# Altium project neuro_module.PrjPcb (part 2 of 2)

## Sheet nm_rs485_phy.SchDoc
size 209 x 297 mm; SheetNumber: 3; SheetTotal: 9
Used 2 times, as channels lm_rs485, sop_rs485. Parts and nets are listed once, with the designators drawn on the sheet.
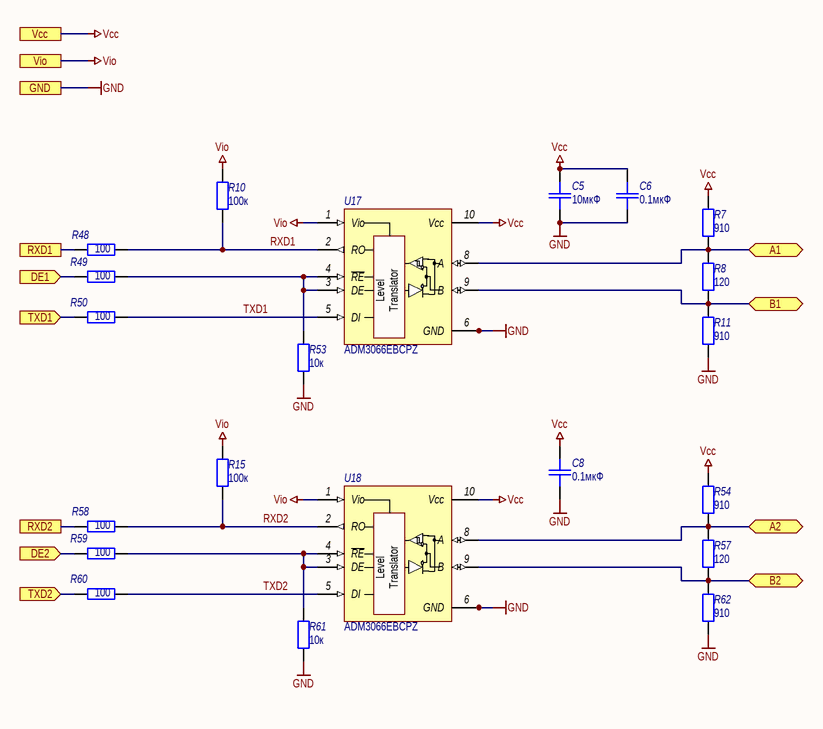
[diagram p7: nm_rs485_phy.SchDoc]

### Parts
C5  value 10мкФ  [SMD_C0603]  (hidden comment: Capacitor)
C6  value 0.1мкФ  [SMD_C0603]  (hidden comment: Capacitor)
C8  value 0.1мкФ  [SMD_C0603]  (hidden comment: Capacitor)
R7  value 910  [SMD_0603]  (hidden comment: Resistor)
R8  value 120  [SMD_0603]  (hidden comment: Resistor)
R10  value 100к  [SMD_0603]  (hidden comment: Resistor)
R11  value 910  [SMD_0603]  (hidden comment: Resistor)
R15  value 100к  [SMD_0603]  (hidden comment: Resistor)
R48  value 100  [SMD_0603]  (hidden comment: Resistor)
R49  value 100  [SMD_0603]  (hidden comment: Resistor)
R50  value 100  [SMD_0603]  (hidden comment: Resistor)
R53  value 10к  [SMD_0603]  (hidden comment: Resistor)
R54  value 910  [SMD_0603]  (hidden comment: Resistor)
R57  value 120  [SMD_0603]  (hidden comment: Resistor)
R58  value 100  [SMD_0603]  (hidden comment: Resistor)
R59  value 100  [SMD_0603]  (hidden comment: Resistor)
R60  value 100  [SMD_0603]  (hidden comment: Resistor)
R61  value 10к  [SMD_0603]  (hidden comment: Resistor)
R62  value 910  [SMD_0603]  (hidden comment: Resistor)
U17  ADM3066EBCPZ  [LFCSP-10_3x3]
U18  ADM3066EBCPZ  [LFCSP-10_3x3]

### Ports
A1 (bidir), A2 (bidir), B1 (bidir), B2 (bidir), DE1 (in), DE2 (in), GND, RXD1, RXD2, TXD1 (in), TXD2 (in), Vcc, Vio

### Nets
GND: C5.1 C6.1 C8.1 R11.1 R53.1 R61.1 R62.1 U17.6(GND) U17.11(GND) U18.6(GND) U18.11(GND) ; port GND
Vcc: C5.2 C6.2 C8.2 R7.1 R54.1 U17.10(Vcc) U18.10(Vcc) ; port Vcc
Vio: R10.1 R15.1 U17.1(Vio) U18.1(Vio) ; port Vio
A1: R7.2 R8.2 U17.8(A) ; port A1
A2: R54.2 R57.2 U18.8(A) ; port A2
B1: R8.1 R11.2 U17.9(B) ; port B1
B2: R57.1 R62.2 U18.9(B) ; port B2
DE1: R49.2 ; port DE1
DE2: R59.2 ; port DE2
RXD1: R10.2 R48.1 U17.2(RO)
RXD1: R48.2 ; port RXD1  [a separate net that carries the same name]
RXD2: R15.2 R58.1 U18.2(RO)
RXD2: R58.2 ; port RXD2  [a separate net that carries the same name]
TXD1: R50.1 U17.5(DI)
TXD1: R50.2 ; port TXD1  [a separate net that carries the same name]
TXD2: R60.1 U18.5(DI)
TXD2: R60.2 ; port TXD2  [a separate net that carries the same name]
NetR49_1: R49.1 R53.2 U17.3(DE) U17.4(~{RE})
NetR59_1: R59.1 R61.2 U18.3(DE) U18.4(~{RE})

### Channels
lm_rs485: designators end in _1; ports A1=A1 A2=A2 B1=B1 B2=B2 DE1=lm_rs485.DE DE2=lm2_rs485.DE GND=GND RXD1=lm_rs485.RX RXD2=lm2_rs485.RX TXD1=lm_rs485.TX TXD2=lm2_rs485.TX Vcc=3V3 Vio=3V3
sop_rs485: designators end in _2; ports A1=A1 A2=A2 B1=B1 B2=B2 DE1=sop_rs485.DE DE2=sop2_rs485.DE GND=GND RXD1=sop_rs485.RX RXD2=sop2_rs485.RX TXD1=sop_rs485.TX TXD2=sop2_rs485.TX Vcc=3V3 Vio=3V3

### Notes on the sheet
- Подп. и дата
- Инв. № дубл.
- Взам. инв. №
- Инв. № подл.
- Изм.
- Лист
- № докум.
- Подп.
- Дата
- Форма 2а ГОСТ 2.104-2006
- Копировал
- Формат А4
- (in symbol ADM3066E) Level; Translator

### Library data of the parts
C5 C6 C8 = Capacitor: Назначение: SMD-конденсатор; Наименование: Конденсатор; Потребление, Вт: 0; Точность: %; Напряжение: В; Диэлектрик: *; Place_v1: *; Place_v2: *
R7 R8 R10 R11 R15 R48-R50 R53 R54 R57-R62 = Resistor: Наименование: Резистор; Назначение: SMD-резистор; Потребление, Вт: 0,001; Точность: %; Place_v1: *; Place_v2: *
U17 U18 = ADM3066E: 3.0 V to 5.5 V, ±12 kV IEC ESD Protected, 500 kbps/50 Mbps RS-485 Transceiver; Потребление, Вт: 0,1; Наименование: ADM3066EBCPZ; Назначение: RS-485 Transceiver; Place_v1: =PL_RS_PLACE; Place_v2: =PL_RS_PLACE

## Sheet nm_temp_sens.SchDoc
size 209 x 297 mm; SheetNumber: 9; SheetTotal: 9
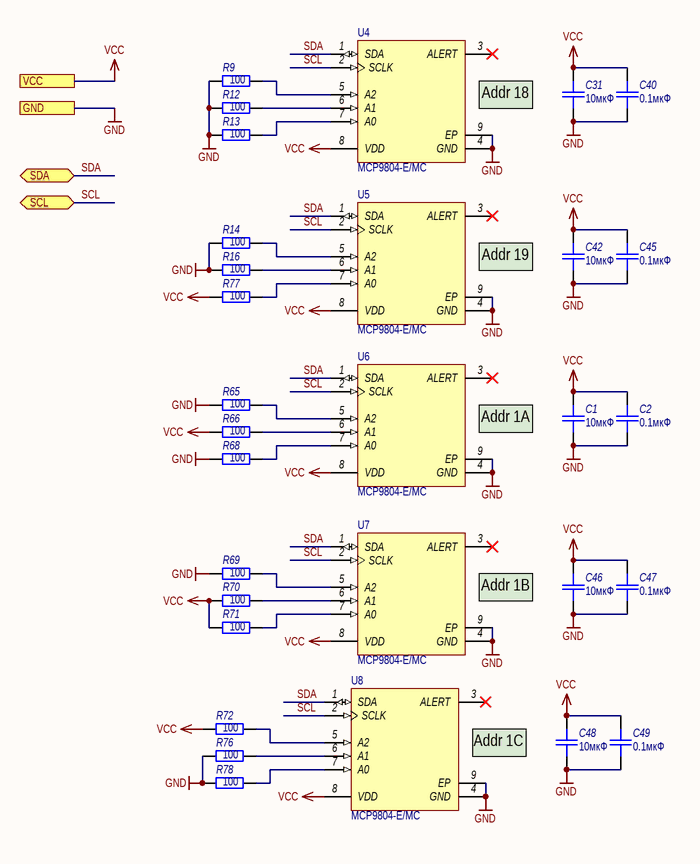
[diagram p8: nm_temp_sens.SchDoc]

### Parts
C1  10мкФ  [SMD_C0603]
C2  0.1мкФ  [SMD_C0603]
C31  10мкФ  [SMD_C0603]
C40  0.1мкФ  [SMD_C0603]
C42  10мкФ  [SMD_C0603]
C45  0.1мкФ  [SMD_C0603]
C46  10мкФ  [SMD_C0603]
C47  0.1мкФ  [SMD_C0603]
C48  10мкФ  [SMD_C0603]
C49  0.1мкФ  [SMD_C0603]
R9  100  [SMD_0603]
R12  100  [SMD_0603]
R13  100  [SMD_0603]
R14  100  [SMD_0603]
R16  100  [SMD_0603]
R65  100  [SMD_0603]
R66  100  [SMD_0603]
R68  100  [SMD_0603]
R69  100  [SMD_0603]
R70  100  [SMD_0603]
R71  100  [SMD_0603]
R72  100  [SMD_0603]
R76  100  [SMD_0603]
R77  100  [SMD_0603]
R78  100  [SMD_0603]
U4  MCP9804-E/MC  [DFN-MC8]
U5  MCP9804-E/MC  [DFN-MC8]
U6  MCP9804-E/MC  [DFN-MC8]
U7  MCP9804-E/MC  [DFN-MC8]
U8  MCP9804-E/MC  [DFN-MC8]

### Ports
GND, SCL (bidir), SDA (bidir), VCC

### Nets
GND: C1.1 C2.1 C31.1 C40.1 C42.1 C45.1 C46.1 C47.1 C48.1 C49.1 R9.1 R12.1 R13.1 R14.1 R16.1 R65.1 R68.1 R69.1 R76.1 R78.1 U4.4(GND) U4.9(EP) U5.4(GND) U5.9(EP) U6.4(GND) U6.9(EP) U7.4(GND) U7.9(EP) U8.4(GND) U8.9(EP) ; port GND
VCC: C1.2 C2.2 C31.2 C40.2 C42.2 C45.2 C46.2 C47.2 C48.2 C49.2 R66.1 R70.1 R71.1 R72.1 R77.1 U4.8(VDD) U5.8(VDD) U6.8(VDD) U7.8(VDD) U8.8(VDD) ; port VCC  [project net 3V3]
SCL: U4.2(SCLK) U5.2(SCLK) U6.2(SCLK) U7.2(SCLK) U8.2(SCLK) ; port SCL
SDA: U4.1(SDA) U5.1(SDA) U6.1(SDA) U7.1(SDA) U8.1(SDA) ; port SDA
NetR9_2: R9.2 U4.5(A2)
NetR12_2: R12.2 U4.6(A1)
NetR13_2: R13.2 U4.7(A0)
NetR14_2: R14.2 U5.5(A2)
NetR16_2: R16.2 U5.6(A1)
NetR65_2: R65.2 U6.5(A2)
NetR66_2: R66.2 U6.6(A1)
NetR68_2: R68.2 U6.7(A0)
NetR69_2: R69.2 U7.5(A2)
NetR70_2: R70.2 U7.6(A1)
NetR71_2: R71.2 U7.7(A0)
NetR72_2: R72.2 U8.5(A2)
NetR76_2: R76.2 U8.6(A1)
NetR77_2: R77.2 U5.7(A0)
NetR78_2: R78.2 U8.7(A0)

Not connected (* = marked no-connect by the designer): U4 3(ALERT)*; U5 3(ALERT)*; U6 3(ALERT)*; U7 3(ALERT)*; U8 3(ALERT)*

### Notes on the sheet
- (near U4) Addr 18
- (near U5) Addr 19
- (near U6) Addr 1A
- (near U7) Addr 1B
- (near U8) Addr 1C
- Перв. примен.
- Справ. №
- Подп. и дата
- Инв. № дубл.
- Взам. инв. №
- Разраб.
- Изм.
- Лист
- № докум.
- Подп.
- Дата
- Литера
- Масса
- Масштаб
- Пров.
- Т.контр.
- Листов
- Инв. № подл.
- Н.контр.
- Утв.
- Форма 1 ГОСТ 2.104-2006
- Копировал
- Формат А4

### Library data of the parts
C1 C2 C31 C40 C42 C45-C49 = Capacitor: as C5 on sheet nm_rs485_phy; Диэлектрик: *; Place_v1: *; Place_v2: *
  C1 C31 C42 C46 C48: Value: 10мкФ
  C2 C40 C45 C47 C49: Value: 0.1мкФ
R9 R12-R14 R16 R65 R66 R68-R72 R76-R78 = Resistor: Наименование: Резистор; Назначение: SMD-резистор; Потребление, Вт: 0,001; Описание: Резистор 0603 10K ±1% 100ppm/°C; Value: 100; Place_v1: *; Place_v2: *
U4-U8 = CMP-0192-00111-1: ±0.25°C Typ. Accuracy Digital Temperature Sensor, 8-Pin DFN, Extended Temperature; PackageVersion: revBB, Aug-2009; PackageDescription: 8-Lead Plastic Dual Flat, No Lead Package (MC) - 2x3x0.9mm Body [DFN]; DatasheetVersion: revA, Sep-2009; PackageReference: DFN-MC8

## Nets that join several sheets
3V3: nm_main (23 pins), nm_mcu (28 pins), pwr_0 (C32_1.2 R17_1.2 U25_1.6), nm_mem (24 pins), pwr_1 (12 pins), nm_3/nm_pwr (C32_3.2 R17_3.2 U25_3.6), lm_rs485 (11 pins), nm_2/nm_pwr (C32_4.2 R17_4.2 U25_4.6), nm_1/nm_pwr (C32_5.2 R17_5.2 R84_5.1 U25_5.6), sop_rs485 (11 pins), nm_temp_sens (20 pins)
CAN1_GND: nm_main (H1.2 H2.2 X7.19 X7.20), nm_sys_can_phy (C43.1 R107.2 U2.8 VD6.3)
CAN1_VCC: nm_main (H1.4 H2.4 X7.13 X7.14), nm_sys_can_phy (C43.2 U2.3)
CAN2_GND: nm_main (H1.6 H2.6 X8.7 X8.8), nm_sys_can_phy (C44.1 R108.2 U3.8 VD7.3)
CAN2_VCC: nm_main (H1.8 H2.8 X8.1 X8.2), nm_sys_can_phy (C44.2 U3.3)
GND: nm_main (65 pins), nm_mcu (30 pins), nm_usb (14 pins), pwr_0 (29 pins), nm_mem (16 pins), nm_sys_can_phy (6 pins), pwr_1 (27 pins), nm_3 (H3_1.2 H3_1.21 VD1_1.2 VD2_1.2), nm_3/nm_pwr (28 pins), lm_rs485 (11 pins), nm_2 (H3_2.2 H3_2.21 VD1_2.2 VD2_2.2), nm_2/nm_pwr (28 pins), nm_1 (H3_3.2 H3_3.21 VD1_3.2 VD2_3.2), nm_1/nm_pwr (28 pins), sop_rs485 (11 pins), nm_temp_sens (30 pins)
VBAT: nm_main (7 pins), pwr_0 (C9_1.2 R20_1.2 TP1_1.0 U19_1.5), pwr_1 (C9_2.2 R20_2.2 TP1_2.0 U19_2.5), nm_3/nm_pwr (C9_3.2 R20_3.2 TP1_3.0 U19_3.5), nm_2/nm_pwr (C9_4.2 R20_4.2 TP1_4.0 U19_4.5), nm_1/nm_pwr (C9_5.2 R20_5.2 TP1_5.0 U19_5.5)
VBUS: nm_3 (H3_1.1), nm_3/nm_pwr (7 pins), nm_2 (H3_2.1), nm_2/nm_pwr (7 pins), nm_1 (H3_3.1), nm_1/nm_pwr (7 pins)
A1: nm_main (P2.3), sop_rs485 (R7_2.2 R8_2.2 U17_2.8)
A1: nm_main (P1.3), lm_rs485 (R7_1.2 R8_1.2 U17_1.8)
A2: nm_main (P2.5), sop_rs485 (R54_2.2 R57_2.2 U18_2.8)
A2: nm_main (P1.5), lm_rs485 (R54_1.2 R57_1.2 U18_1.8)
B1: nm_main (P2.4), sop_rs485 (R8_2.1 R11_2.2 U17_2.9)
B1: nm_main (P1.4), lm_rs485 (R8_1.1 R11_1.2 U17_1.9)
B2: nm_main (P2.6), sop_rs485 (R57_2.1 R62_2.2 U18_2.9)
B2: nm_main (P1.6), lm_rs485 (R57_1.1 R62_1.2 U18_1.9)
CAN1_H: nm_main (H1.3 H2.3 X7.15 X7.16), nm_sys_can_phy (R18.2 U2.7 VD6.2)
CAN1_L: nm_main (H1.1 H2.1 X7.17 X7.18), nm_sys_can_phy (R18.1 U2.6 VD6.1)
CAN2_H: nm_main (H1.7 H2.7 X8.3 X8.4), nm_sys_can_phy (R67.2 U3.7 VD7.2)
CAN2_L: nm_main (H1.5 H2.5 X8.5 X8.6), nm_sys_can_phy (R67.1 U3.6 VD7.1)
CAN_RX1: nm_mcu (U1.E13), nm_sys_can_phy (R19.2 R56.2)
CAN_RX2: nm_mcu (U1.L13), nm_sys_can_phy (R55.2 R102.2)
CAN_TX1: nm_mcu (U1.E12), nm_sys_can_phy (R6.2)
CAN_TX2: nm_mcu (U1.K14), nm_sys_can_phy (R75.2)
DEBUG_RX: nm_main (P3.2), nm_1 (R63_3.1)
DEBUG_RX: nm_main (P4.2), nm_2 (R63_2.1)
DEBUG_RX: nm_main (P5.2), nm_3 (R63_1.1)
DEBUG_TX: nm_main (P3.1), nm_1 (R64_3.1)
DEBUG_TX: nm_main (P4.1), nm_2 (R64_2.1)
DEBUG_TX: nm_main (P5.1), nm_3 (R64_1.1)
FLASH_CS: nm_mcu (U1.P12), nm_mem (R101.2 U21.1)
FLASH_HOLD_IO3: nm_mcu (U1.N2), nm_mem (U21.7)
FLASH_MISO_IO1: nm_mcu (U1.L2), nm_mem (U21.2)
FLASH_MOSI_IO0: nm_mcu (U1.N10), nm_mem (U21.5)
FLASH_SCK: nm_mcu (U1.L1), nm_mem (U21.6)
FLASH_WP_IO2: nm_mcu (U1.K1), nm_mem (U21.3)
LED_CONNECTION: nm_main (R1.1), nm_mcu (U1.R4)
LED_MCU_STATE: nm_main (R2.1), nm_mcu (U1.R5)
lm2_rs485.DE: nm_mcu (U1.D11), lm_rs485 (R59_1.2)
lm2_rs485.RX: nm_mcu (U1.R2), lm_rs485 (R58_1.2)
lm2_rs485.TX: nm_mcu (U1.P2), lm_rs485 (R60_1.2)
lm_rs485.DE: nm_mcu (U1.A13), lm_rs485 (R49_1.2)
lm_rs485.RX: nm_mcu (U1.B12), lm_rs485 (R48_1.2)
lm_rs485.TX: nm_mcu (U1.C12), lm_rs485 (R50_1.2)
MEM_CS0: nm_mcu (U1.P9), nm_mem (DS1.1 R97.2)
MEM_CS1: nm_mcu (U1.R9), nm_mem (DS2.1 R98.2)
MEM_CS2: nm_mcu (U1.P10), nm_mem (DS3_(DNP).1 R99.2)
MEM_CS3: nm_mcu (U1.R10), nm_mem (DS4_(DNP).1 R100.2)
MEM_MISO: nm_mcu (U1.P3), nm_mem (DS1.2 DS2.2 DS3_(DNP).2 DS4_(DNP).2)
MEM_MOSI: nm_mcu (U1.R3), nm_mem (DS1.5 DS2.5 DS3_(DNP).5 DS4_(DNP).5)
MEM_SCK: nm_mcu (U1.P4), nm_mem (DS1.6 DS2.6 DS3_(DNP).6 DS4_(DNP).6)
nm_bus1.Ena: nm_mcu (U1.M3), nm_1/nm_pwr (R25_5.2 R26_5.2 R29_5.2)
nm_bus1.RX: nm_mcu (U1.B13), nm_1 (H3_3.10)
nm_bus1.TX: nm_mcu (U1.B14), nm_1 (H3_3.11)
nm_bus2.Ena: nm_mcu (U1.M4), nm_2/nm_pwr (R25_4.2 R26_4.2 R29_4.2)
nm_bus2.RX: nm_mcu (U1.D9), nm_2 (H3_2.10)
nm_bus2.TX: nm_mcu (U1.A4), nm_2 (H3_2.11)
nm_bus3.Ena: nm_mcu (U1.L4), nm_3/nm_pwr (R25_3.2 R26_3.2 R29_3.2)
nm_bus3.RX: nm_mcu (U1.A6), nm_3 (H3_1.10)
nm_bus3.TX: nm_mcu (U1.A5), nm_3 (H3_1.11)
NRST: nm_main (R88.2 X2.1), nm_mcu (U1.J1)
Reserve_0: nm_main (R105.1), nm_mcu (U1.F14)
Reserve_1: nm_main (R106.1), nm_mcu (U1.F15)
rx_dbg: nm_main (R95.1), nm_mcu (U1.R15)
SCL: nm_main (R4.1 TP4.0), nm_mcu (U1.A7), pwr_0 (U25_1.5), pwr_1 (U25_2.5), nm_3/nm_pwr (R84_3.1 U25_3.5), nm_2/nm_pwr (U25_4.5), nm_1/nm_pwr (U25_5.5), nm_temp_sens (5 pins)
SDA: nm_main (R5.1 TP5.0), nm_mcu (U1.B4), pwr_0 (U25_1.4), pwr_1 (U25_2.4), nm_3/nm_pwr (U25_3.4), nm_2/nm_pwr (R84_4.1 U25_4.4), nm_1/nm_pwr (U25_5.4), nm_temp_sens (5 pins)
sop2_rs485.DE: nm_mcu (U1.L3), sop_rs485 (R59_2.2)
sop2_rs485.RX: nm_mcu (U1.K2), sop_rs485 (R58_2.2)
sop2_rs485.TX: nm_mcu (U1.A9), sop_rs485 (R60_2.2)
sop_rs485.DE: nm_mcu (U1.G14), sop_rs485 (R49_2.2)
sop_rs485.RX: nm_mcu (U1.A8), sop_rs485 (R48_2.2)
sop_rs485.TX: nm_mcu (U1.A12), sop_rs485 (R50_2.2)
SWCLK: nm_main (R94.2 X2.6), nm_mcu (U1.A14)
SWDIO: nm_main (R92.1 X2.2), nm_mcu (U1.A15)
SWO: nm_main (R93.1 X2.5), nm_mcu (U1.A10)
SYS_CLK: nm_main (R87.2), nm_mcu (U1.G1)
tx_dbg: nm_main (R96.1), nm_mcu (U1.R14)
USB_5V: nm_main (NT1.1), nm_usb (VD3.1)
USB_D_N: nm_mcu (U1.C15), nm_usb (C30.2 R47.2)
USB_D_P: nm_mcu (U1.B15), nm_usb (C29.2 R46.2)
V_out: nm_main (NT2.1), pwr_0 (7 pins)